# EAGLE design Untitled (EAGLE 6.4)
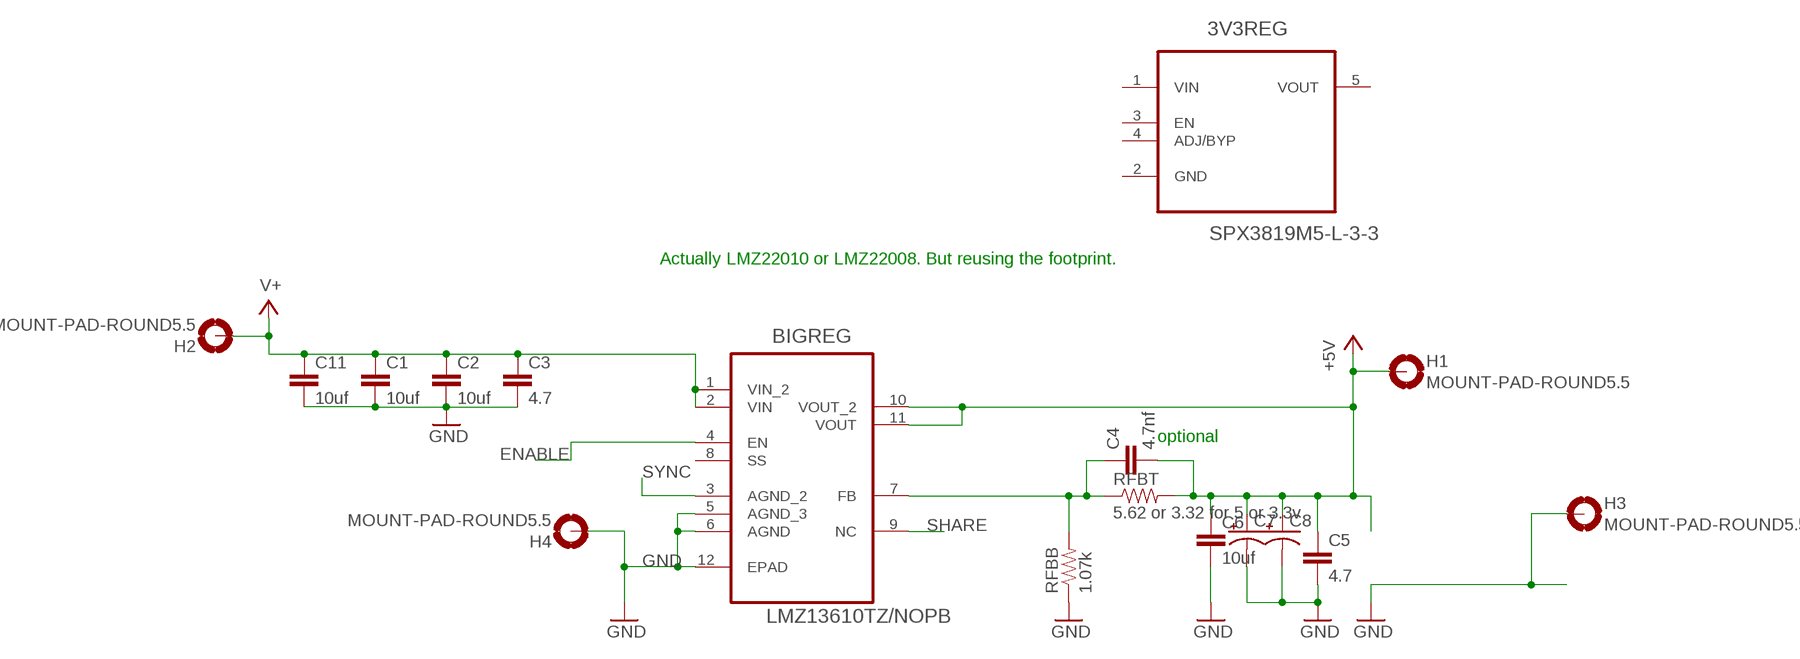
[diagram p0: schematic, sheet 1]

## Parts
3V3REG  SPX3819M5-L-3-3  [SOT95P280X145-5N]
BIGREG  LMZ13610TZ/NOPB  [TI_TO-PMOD-11]
C1  10uf  CAP1206  [1206]
C2  10uf  CAP1206  [1206]
C3  4.7  CAP1206  [1206]
C4  4.7nf  CAP0603-CAP  [0603-CAP]
C5  4.7  CAP1206  [1206]
C6  10uf  CAP1206  [1206]
C7  CAP_POLPTH2  [CPOL-RADIAL-10UF-25V]
C8  CAP_POLPTH2  [CPOL-RADIAL-10UF-25V]
C11  10uf  CAP1206  [1206]
H1  MOUNT-PAD-ROUND5.5  [5,5-PAD]
H2  MOUNT-PAD-ROUND5.5  [5,5-PAD]
H3  MOUNT-PAD-ROUND5.5  [5,5-PAD]
H4  MOUNT-PAD-ROUND5.5  [5,5-PAD]
RFBB  1.07k  RESISTOR0603  [0603-RES]
RFBT  5.62 or 3.32 for 5 or 3.3v  RESISTOR0603  [0603-RES]

## Nets
+5V: BIGREG.10(VOUT_2) BIGREG.11(VOUT) C4.2 C5.1 C6.1 C7.1(+) C8.1(+) H1.B5,5(MOUNT) RFBT.2
ENABLE: BIGREG.4(EN)
GND: BIGREG.5(AGND_3) BIGREG.6(AGND) BIGREG.12(EPAD) C1.2 C2.2 C3.2 C5.2 C6.2 C7.2(-) C8.2(-) C11.2 H3.B5,5(MOUNT) H4.B5,5(MOUNT) RFBB.1
N$2: BIGREG.7(FB) C4.1 RFBB.2 RFBT.1
SHARE: BIGREG.9(NC)
SYNC: BIGREG.3(AGND_2)
V+: BIGREG.1(VIN_2) BIGREG.2(VIN) C1.1 C2.1 C3.1 C11.1 H2.B5,5(MOUNT)
Unconnected: 3V3REG.2(GND) 3V3REG.3(EN) 3V3REG.4(ADJ/BYP) 3V3REG.5(VOUT) BIGREG.8(SS)

## Notes on the sheet
- Actually LMZ22010 or LMZ22008. But reusing the footprint.
- optional

## Power pins joined to a net without a drawn wire
VIN: 3V3REG.1(VIN)

## Library data of the parts
3V3REG = James:SPX3819M5-L-3-3: 500mA, LOW-NOISE LDO VOLTAGE REGULATOR; MPN: SPX3819M5-L-3-3; OC_FARNELL: 1831949; OC_NEWARK: 23R9702; PACKAGE: SOT-23-5; SUPPLIER: EXAR
BIGREG = TI-Eagle_library:LMZ13610TZ/NOPB: BUCK, SYNC, ADJ, 10A, TO-PMOD-11; MPN: LMZ13610TZ/NOPB; OC_FARNELL: 1922943; OC_NEWARK: 47T7393; PACKAGE: TO-PMOD-11; SUPPLIER: TEXAS INSTRUMENTS
C1-C3 C5 C6 C11 = SparkFun-Capacitors:CAP: Capacitor Standard 0603 ceramic capacitor, and 0.1" leaded capacitor.
C4 = SparkFun-Passives:CAP: Capacitor Standard 0603 ceramic capacitor, and 0.1" leaded capacitor.
C7 C8 = SparkFun-Capacitors:CAP_POL: Capacitor Polarized These are standard SMD and PTH capacitors. Normally 10uF, 47uF, and 100uF in electrolytic and tantalum varieties. Always verify the external diameter of the through hole cap, it varies with capacity, voltage, and manufacturer. The EIA devices should be standard.
H1-H4 = holes:MOUNT-PAD-ROUND: MOUNTING PAD, round
RFBB RFBT = SparkFun-Resistors:RESISTOR: Resistor Basic schematic elements and footprints for 0603, 1206, and PTH resistors.

## Net classes
0 default: width 0.762 mm

## Board
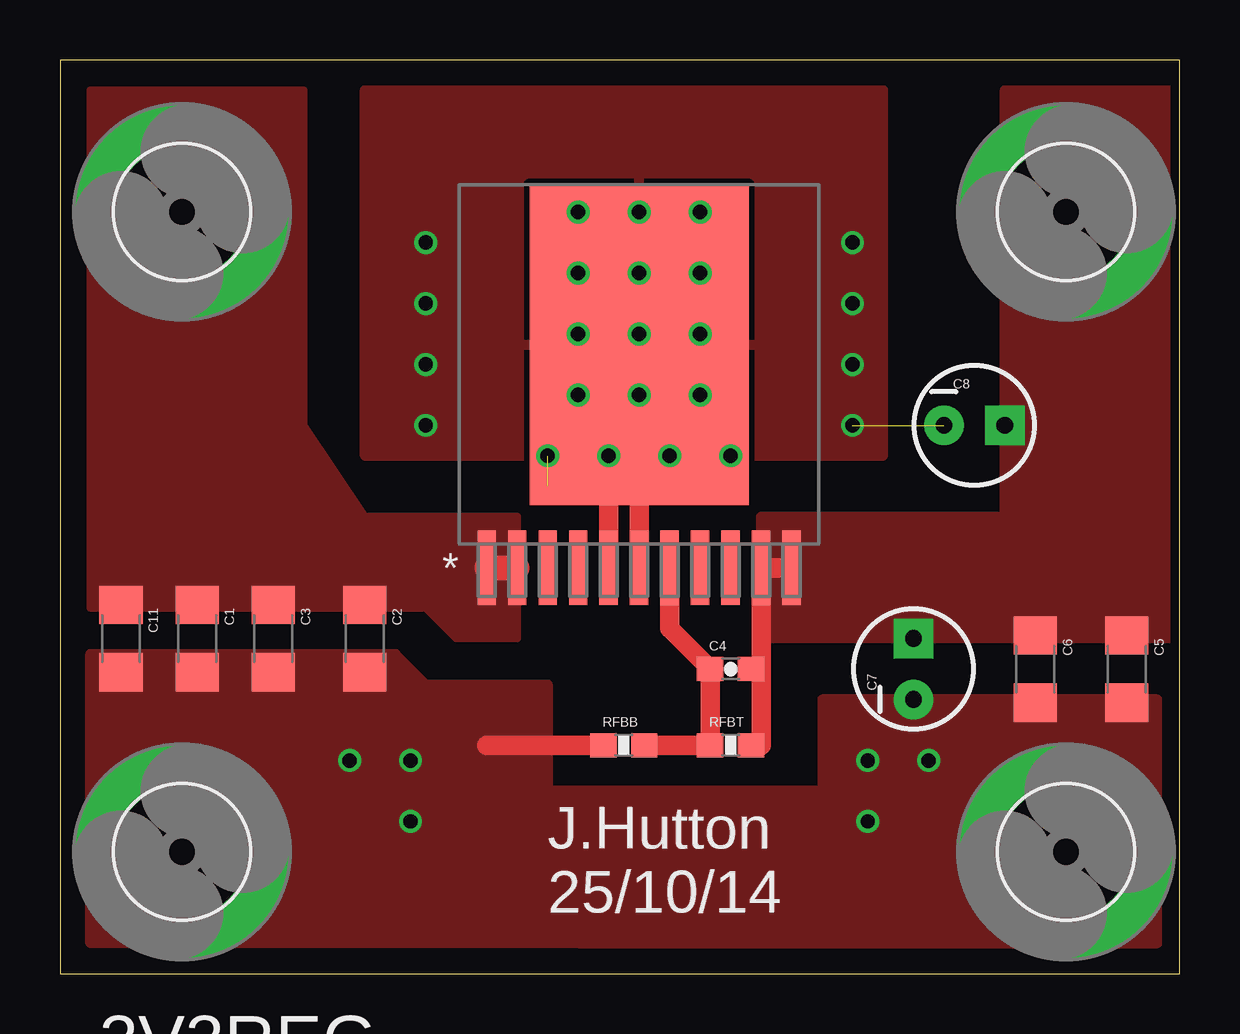
[diagram p1: board, top side]
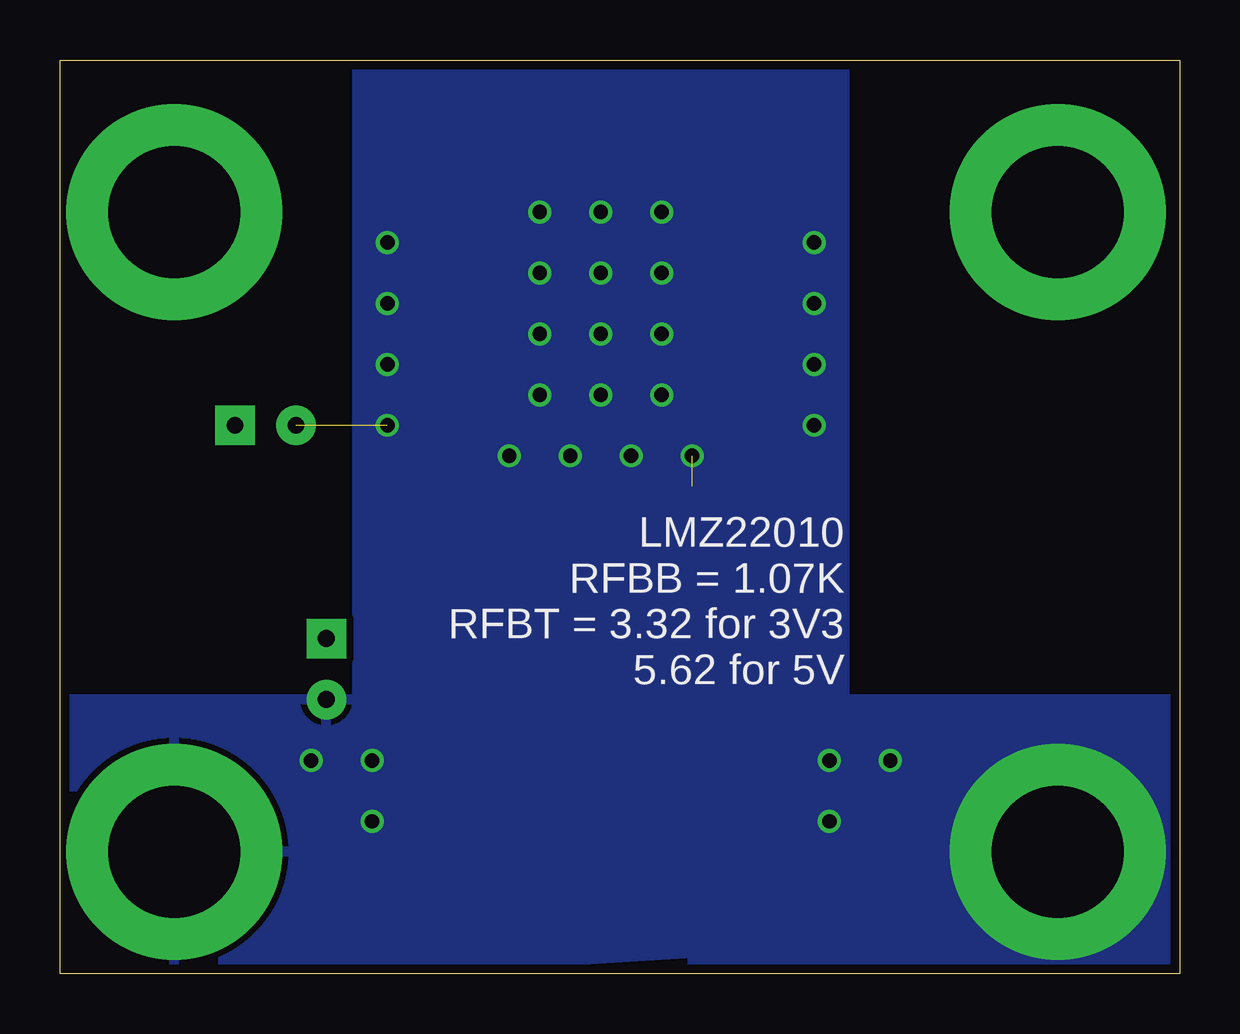
[diagram p2: board, bottom side, seen from below]

Size 46.66 x 38.09 mm. Coordinates in mm from the lower left corner, seen from the top.
Outline: 0,0 46.66,0 46.66,38.09 0,38.09 0,0
Copper layers (1*16): Top 0.0356mm / dielectric 1.5011mm / Bottom 0.0356mm
Design rules "LaenPCBOrder": minimum track width 6mil, minimum drill 13mil, track to track 6mil, track to pad 6mil, pad to pad 6mil, via to via 6mil, smd to smd 6mil, copper to edge 15mil, drill to drill 6mil, minimum pad ring 7mil, minimum via ring 7mil, stop-mask expansion 3mil, vias tented up to drill 0mil, thermal gap 10mil

### Footprints (pad centres in the part's own frame; a part is rotated, then mirrored left to right if it is on the bottom)
SOT95P280X145-5N = smd 1.321 x 0.559: 1 -1.168,0.94; 2 -1.168,0; 3 -1.168,-0.94; 4 1.168,-0.94; 5 1.168,0.94
TI_TO-PMOD-11 = smd 0.762 x 3.099: 1 -6.35,-8.484; 2 -5.08,-8.484; 3 -3.81,-8.484; 4 -2.54,-8.484; 5 -1.27,-8.484; 6 0,-8.484; 7 1.27,-8.484; 8 2.54,-8.484; 9 3.81,-8.484; 10 5.08,-8.484; 11 6.35,-8.484 | smd 9.126 x 13.37: 12 0,0.816
1206 = smd 1.6 x 1.8: 1 -1.4,0; 2 1.4,0
0603-CAP = smd 1.1 x 1: 1 -0.85,0; 2 0.85,0
CPOL-RADIAL-10UF-25V = drill 0.7 pad 1.651 square: 1 1.27,0 | drill 0.7 pad 1.651: 2 -1.27,0
5,5-PAD = drill 5.5 pad 9: B5,5 0,0
0603-RES = smd 1.1 x 1: 1 -0.85,0; 2 0.85,0

### Placement (x,y rotation side)
3V3REG  5.08,-6.35 0 top  (outside the outline)
BIGREG  24.13,25.4 0 top
C1  5.71,13.97 270 top
C2  12.7,13.97 270 top
C3  8.89,13.97 270 top
C4  27.94,12.7 0 top
C5  44.45,12.7 270 top
C6  40.64,12.7 270 top
C7  35.56,12.7 90 top
C8  38.1,22.86 0 top
C11  2.54,13.97 270 top
H1  41.91,31.75 0 top
H2  5.08,31.75 0 top
H3  41.91,5.08 0 top
H4  5.08,5.08 0 top
RFBB  23.5,9.53 0 top
RFBT  27.94,9.53 0 top

### Tracks (layer width: path | path; a pad name or v marks a point on that pad's centre or on a via)
+5V
  Top 0.813: 29.21,12.7 BIGREG.10 | 29.21,17.78 BIGREG.10 | BIGREG.10 BIGREG.11 | RFBT.2 29.21,9.53 29.21,12.7 | 29.21,12.7 C4.2
  pour Top (isolate 0.305, no thermals): 39.37,36.83 46.99,36.83 46.99,13.97 29.21,13.97 29.21,19.05 39.37,19.05
GND  (via drill 0.6)  (2 unrouted)
  Top 0.813: 20.32,20.32 22.86,20.32 | 22.86,20.32 BIGREG.5 | BIGREG.6 24.13,20.32 22.86,20.32 | RFBB.1 17.78,9.53
  other vias: 22.86,21.59 27.94,21.59 20.32,21.59 25.4,21.59 15.24,25.4 15.24,30.48 15.24,22.86 15.24,27.94 21.59,29.21 21.59,24.13 21.59,31.75 21.59,26.67 26.67,26.67 26.67,31.75 26.67,24.13 26.67,29.21 33.02,25.4 33.02,30.48 33.02,22.86 33.02,27.94 24.13,26.67 24.13,31.75 24.13,24.13 24.13,29.21 33.66,8.89 36.2,8.89 33.66,6.35 12.06,8.89 14.61,8.89 14.61,6.35
  pour Bottom (isolate 0.305, no thermals): 13.97,39.37 34.29,38.1 34.29,0 13.97,1.27
  pour Top (isolate 0.305, rank 2): 12.7,36.83 34.29,36.83 34.29,21.59 12.7,21.59
  pour Top (isolate 0.305, no thermals): 31.75,11.43 31.75,7.62 20.32,7.62 21.59,1.27 45.72,1.27 45.72,11.43
  pour Top (isolate 0.305, no thermals): 1.27,6.35 6.35,6.35 7.62,5.08 24.13,5.08 24.13,1.27 1.27,1.27
  pour Top (isolate 0.305, no thermals): 1.27,13.34 13.97,13.34 15.24,12.06 20.32,12.06 20.32,5.08 1.27,5.08
  pour Bottom: 27.94,11.43 46.99,11.43 46.99,-1.27 27.94,-1.27
  pour Bottom (no thermals): 0,11.43 20.32,11.43 20.32,0 0,0
N$2
  Top 0.813: BIGREG.7 25.4,14.39 C4.1 RFBT.1 RFBB.2
V+
  Top 1.016: BIGREG.1 BIGREG.2
  pour Top (isolate 0.305, no thermals): 19.05,13.97 19.05,19.05 12.7,19.05 10.16,22.86 10.16,36.83 1.27,36.83 1.27,15.24 15.24,15.24 16.51,13.97

### Text on the board
tNames: J.Hutton / 25/10/14
bNames: LMZ22010 / RFBB = 1.07K / RFBT = 3.32 for 3V3 / 5.62 for 5V
tValues: LMZ22010 - 20Vin Max